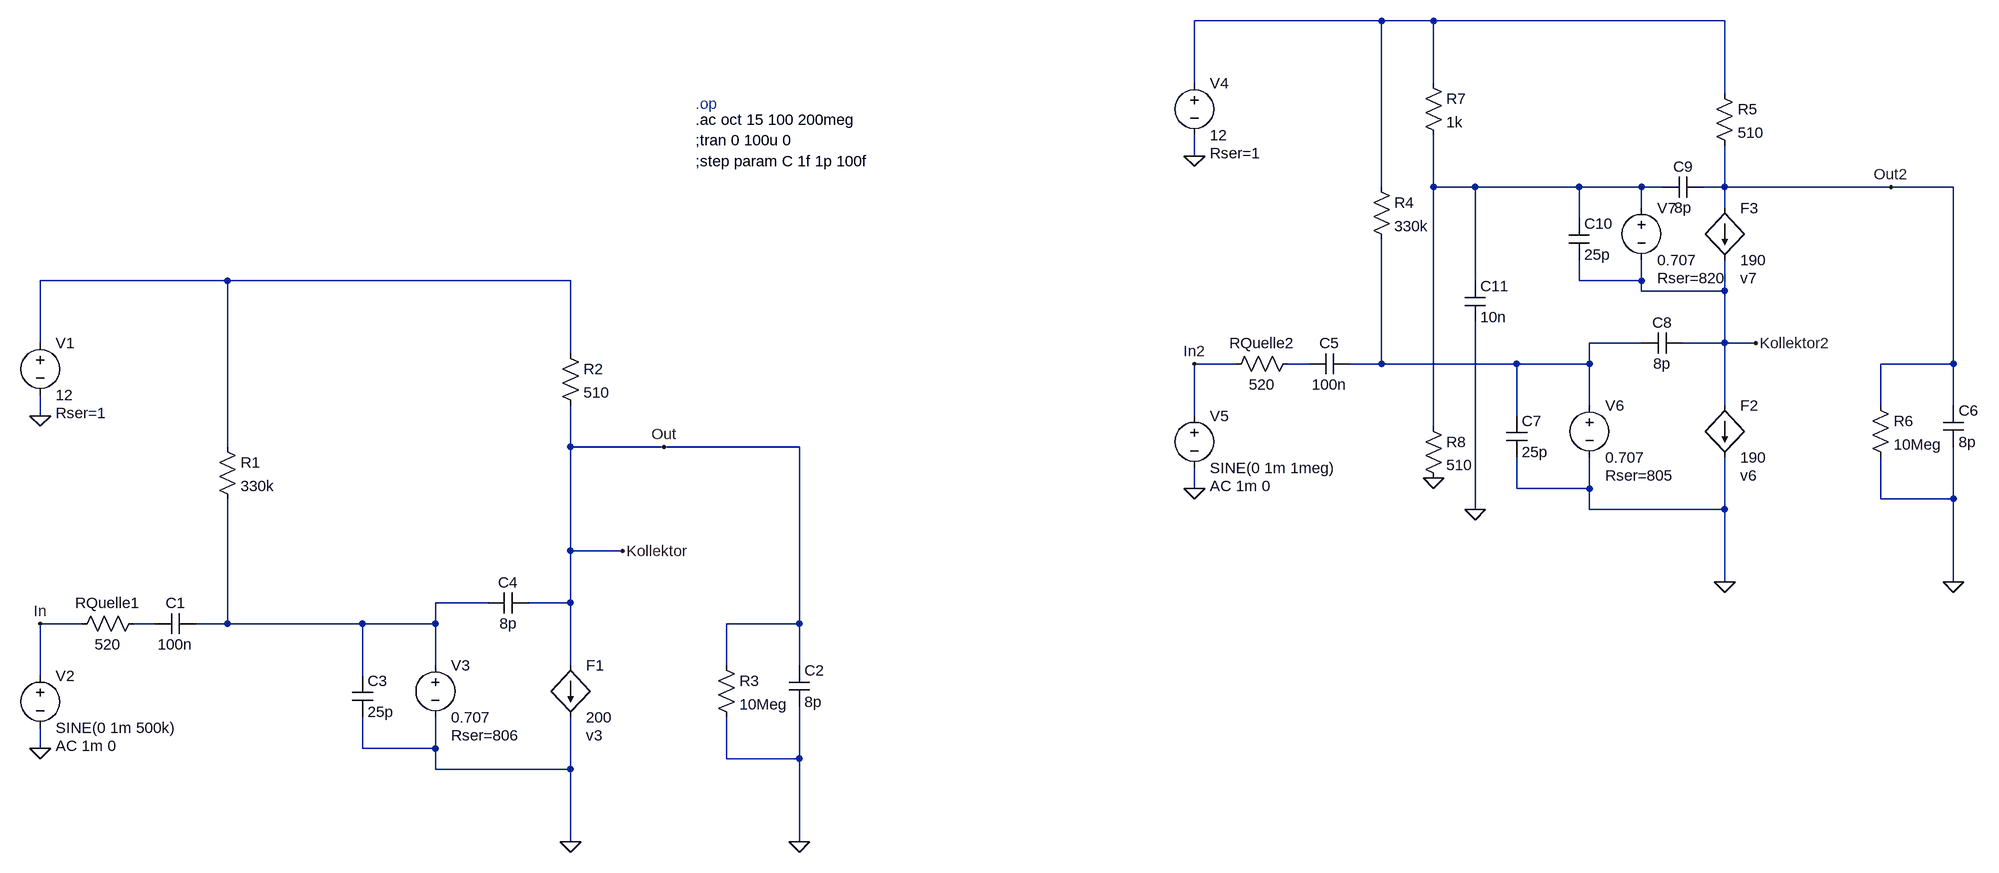
[diagram p0: schematic 1-5-4.asc]
1-5-4.asc, the LTspice schematic file:
Version 4.1
SHEET 1 1576 820
WIRE 656 -464 368 -464
WIRE 736 -464 656 -464
WIRE 1184 -464 736 -464
WIRE 368 -368 368 -464
WIRE 736 -368 736 -464
WIRE 1184 -352 1184 -464
WIRE 368 -256 368 -288
WIRE 656 -208 656 -464
WIRE 736 -208 736 -288
WIRE 800 -208 736 -208
WIRE 960 -208 800 -208
WIRE 1056 -208 960 -208
WIRE 1088 -208 1056 -208
WIRE 1184 -208 1184 -272
WIRE 1184 -208 1152 -208
WIRE 1440 -208 1184 -208
WIRE 1536 -208 1440 -208
WIRE 1056 -176 1056 -208
WIRE 1184 -176 1184 -208
WIRE 960 -160 960 -208
WIRE -1120 -64 -1408 -64
WIRE -592 -64 -1120 -64
WIRE 800 -64 800 -208
WIRE 960 -64 960 -96
WIRE 1056 -64 1056 -96
WIRE 1056 -64 960 -64
WIRE 1056 -48 1056 -64
WIRE 1184 -48 1184 -96
WIRE 1184 -48 1056 -48
WIRE -1408 32 -1408 -64
WIRE 1056 32 976 32
WIRE 1184 32 1184 -48
WIRE 1184 32 1120 32
WIRE 1232 32 1184 32
WIRE -592 48 -592 -64
WIRE 432 64 368 64
WIRE 544 64 512 64
WIRE 656 64 656 -128
WIRE 656 64 608 64
WIRE 864 64 656 64
WIRE 976 64 976 32
WIRE 976 64 864 64
WIRE 1536 64 1536 -208
WIRE 1536 64 1424 64
WIRE 976 128 976 64
WIRE 1184 128 1184 32
WIRE 1424 128 1424 64
WIRE 1536 128 1536 64
WIRE -1408 144 -1408 112
WIRE 368 144 368 64
WIRE 864 144 864 64
WIRE 736 160 736 -208
WIRE -1120 192 -1120 -64
WIRE -592 192 -592 128
WIRE -448 192 -592 192
WIRE -240 192 -448 192
WIRE 368 256 368 224
WIRE 864 256 864 208
WIRE 976 256 976 208
WIRE 976 256 864 256
WIRE 1424 272 1424 208
WIRE 1536 272 1536 192
WIRE 1536 272 1424 272
WIRE 800 288 800 0
WIRE 976 288 976 256
WIRE 1184 288 1184 208
WIRE 1184 288 976 288
WIRE -592 352 -592 192
WIRE -512 352 -592 352
WIRE 1184 400 1184 288
WIRE 1536 400 1536 272
WIRE -720 432 -800 432
WIRE -592 432 -592 352
WIRE -592 432 -656 432
WIRE -1344 464 -1408 464
WIRE -1232 464 -1264 464
WIRE -1120 464 -1120 272
WIRE -1120 464 -1168 464
WIRE -912 464 -1120 464
WIRE -800 464 -800 432
WIRE -800 464 -912 464
WIRE -240 464 -240 192
WIRE -240 464 -352 464
WIRE -800 528 -800 464
WIRE -592 528 -592 432
WIRE -352 528 -352 464
WIRE -240 528 -240 464
WIRE -1408 544 -1408 464
WIRE -912 544 -912 464
WIRE -1408 656 -1408 624
WIRE -912 656 -912 608
WIRE -800 656 -800 608
WIRE -800 656 -912 656
WIRE -352 672 -352 608
WIRE -240 672 -240 592
WIRE -240 672 -352 672
WIRE -800 688 -800 656
WIRE -592 688 -592 608
WIRE -592 688 -800 688
WIRE -592 800 -592 688
WIRE -240 800 -240 672
FLAG -1408 656 0
FLAG -1408 144 0
FLAG -592 800 0
FLAG -240 800 0
FLAG -1408 464 In
FLAG -512 352 Kollektor
FLAG -448 192 Out
FLAG 368 256 0
FLAG 368 -256 0
FLAG 1184 400 0
FLAG 1536 400 0
FLAG 368 64 In2
FLAG 736 240 0
FLAG 800 288 0
FLAG 1232 32 Kollektor2
FLAG 1440 -208 Out2
SYMBOL voltage -1408 16 R0
WINDOW 123 0 0 Left 0
WINDOW 39 24 124 Left 2
SYMATTR SpiceLine Rser=1
SYMATTR InstName V1
SYMATTR Value 12
SYMBOL voltage -1408 528 R0
WINDOW 123 24 124 Left 2
WINDOW 39 0 0 Left 0
SYMATTR Value2 AC 1m 0
SYMATTR InstName V2
SYMATTR Value SINE(0 1m 500k)
SYMBOL voltage -800 512 R0
WINDOW 123 0 0 Left 0
WINDOW 39 24 124 Left 2
SYMATTR SpiceLine Rser=806
SYMATTR InstName V3
SYMATTR Value 0.707
SYMBOL f -592 528 R0
WINDOW 38 24 108 Left 2
SYMATTR SpiceModel v3
SYMATTR InstName F1
SYMATTR Value 200
SYMBOL cap -1168 448 R90
WINDOW 0 0 32 VBottom 2
WINDOW 3 32 32 VTop 2
SYMATTR InstName C1
SYMATTR Value 100n
SYMBOL res -1136 176 R0
SYMATTR InstName R1
SYMATTR Value 330k
SYMBOL res -608 32 R0
SYMATTR InstName R2
SYMATTR Value 510
SYMBOL res -368 512 R0
SYMATTR InstName R3
SYMATTR Value 10Meg
SYMBOL cap -256 528 R0
SYMATTR InstName C2
SYMATTR Value 8p
SYMBOL cap -928 544 R0
SYMATTR InstName C3
SYMATTR Value 25p
SYMBOL cap -656 416 R90
WINDOW 0 0 32 VBottom 2
WINDOW 3 32 32 VTop 2
SYMATTR InstName C4
SYMATTR Value 8p
SYMBOL res -1248 448 R90
WINDOW 0 0 56 VBottom 2
WINDOW 3 32 56 VTop 2
SYMATTR InstName RQuelle1
SYMATTR Value 520
SYMBOL voltage 368 -384 R0
WINDOW 123 0 0 Left 0
WINDOW 39 24 124 Left 2
SYMATTR SpiceLine Rser=1
SYMATTR InstName V4
SYMATTR Value 12
SYMBOL voltage 368 128 R0
WINDOW 123 24 124 Left 2
WINDOW 39 0 0 Left 0
SYMATTR Value2 AC 1m 0
SYMATTR InstName V5
SYMATTR Value SINE(0 1m 1meg)
SYMBOL voltage 976 112 R0
WINDOW 123 0 0 Left 0
WINDOW 39 24 124 Left 2
SYMATTR SpiceLine Rser=805
SYMATTR InstName V6
SYMATTR Value 0.707
SYMBOL f 1184 128 R0
WINDOW 38 24 108 Left 2
SYMATTR SpiceModel v6
SYMATTR InstName F2
SYMATTR Value 190
SYMBOL cap 608 48 R90
WINDOW 0 0 32 VBottom 2
WINDOW 3 32 32 VTop 2
SYMATTR InstName C5
SYMATTR Value 100n
SYMBOL res 640 -224 R0
SYMATTR InstName R4
SYMATTR Value 330k
SYMBOL res 1168 -368 R0
SYMATTR InstName R5
SYMATTR Value 510
SYMBOL res 1408 112 R0
SYMATTR InstName R6
SYMATTR Value 10Meg
SYMBOL cap 1520 128 R0
SYMATTR InstName C6
SYMATTR Value 8p
SYMBOL cap 848 144 R0
SYMATTR InstName C7
SYMATTR Value 25p
SYMBOL cap 1120 16 R90
WINDOW 0 0 32 VBottom 2
WINDOW 3 32 32 VTop 2
SYMATTR InstName C8
SYMATTR Value 8p
SYMBOL res 528 48 R90
WINDOW 0 0 56 VBottom 2
WINDOW 3 32 56 VTop 2
SYMATTR InstName RQuelle2
SYMATTR Value 520
SYMBOL res 720 -384 R0
SYMATTR InstName R7
SYMATTR Value 1k
SYMBOL res 720 144 R0
SYMATTR InstName R8
SYMATTR Value 510
SYMBOL cap 1152 -224 R90
WINDOW 0 0 32 VBottom 2
WINDOW 3 32 32 VTop 2
SYMATTR InstName C9
SYMATTR Value 8p
SYMBOL voltage 1056 -192 R0
WINDOW 123 0 0 Left 0
WINDOW 39 24 124 Left 2
SYMATTR SpiceLine Rser=820
SYMATTR InstName V7
SYMATTR Value 0.707
SYMBOL cap 944 -160 R0
SYMATTR InstName C10
SYMATTR Value 25p
SYMBOL f 1184 -176 R0
WINDOW 38 24 108 Left 2
SYMATTR SpiceModel v7
SYMATTR InstName F3
SYMATTR Value 190
SYMBOL cap 784 -64 R0
SYMATTR InstName C11
SYMATTR Value 10n
TEXT -400 -336 Left 2 ;.op
TEXT -400 -312 Left 2 !.ac oct 15 100 200meg
TEXT -400 -280 Left 2 !;tran 0 100u 0
TEXT -400 -248 Left 2 !;step param C 1f 1p 100f

The netlist it stands for:
* 1-5-4.asc
V1 N003 0 12 Rser=1
V2 In 0 SINE(0 1m 500k) AC 1m 0
V3 N006 0 0.707 Rser=806
F1 Out 0 v3 200
C1 N006 N007 100n
R1 N003 N006 330k
R2 N003 Out 510
R3 Out 0 10Meg
C2 Out 0 8p
C3 N006 0 25p
C4 Out N006 8p
RQuelle1 N007 In 520
V4 N001 0 12 Rser=1
V5 In2 0 SINE(0 1m 1meg) AC 1m 0
V6 N004 0 0.707 Rser=805
F2 Kollektor2 0 v6 190
C5 N004 N005 100n
R4 N001 N004 330k
R5 N001 Out2 510
R6 Out2 0 10Meg
C6 Out2 0 8p
C7 N004 0 25p
C8 Kollektor2 N004 8p
RQuelle2 N005 In2 520
R7 N001 N002 1k
R8 N002 0 510
C9 Out2 N002 8p
V7 N002 Kollektor2 0.707 Rser=820
C10 N002 Kollektor2 25p
F3 Out2 Kollektor2 v7 190
C11 N002 0 10n
* .op
.ac oct 15 100 200meg
;tran 0 100u 0
;step param C 1f 1p 100f
.backanno
.end